# Altium project RJ45_Breakout.PrjPCB
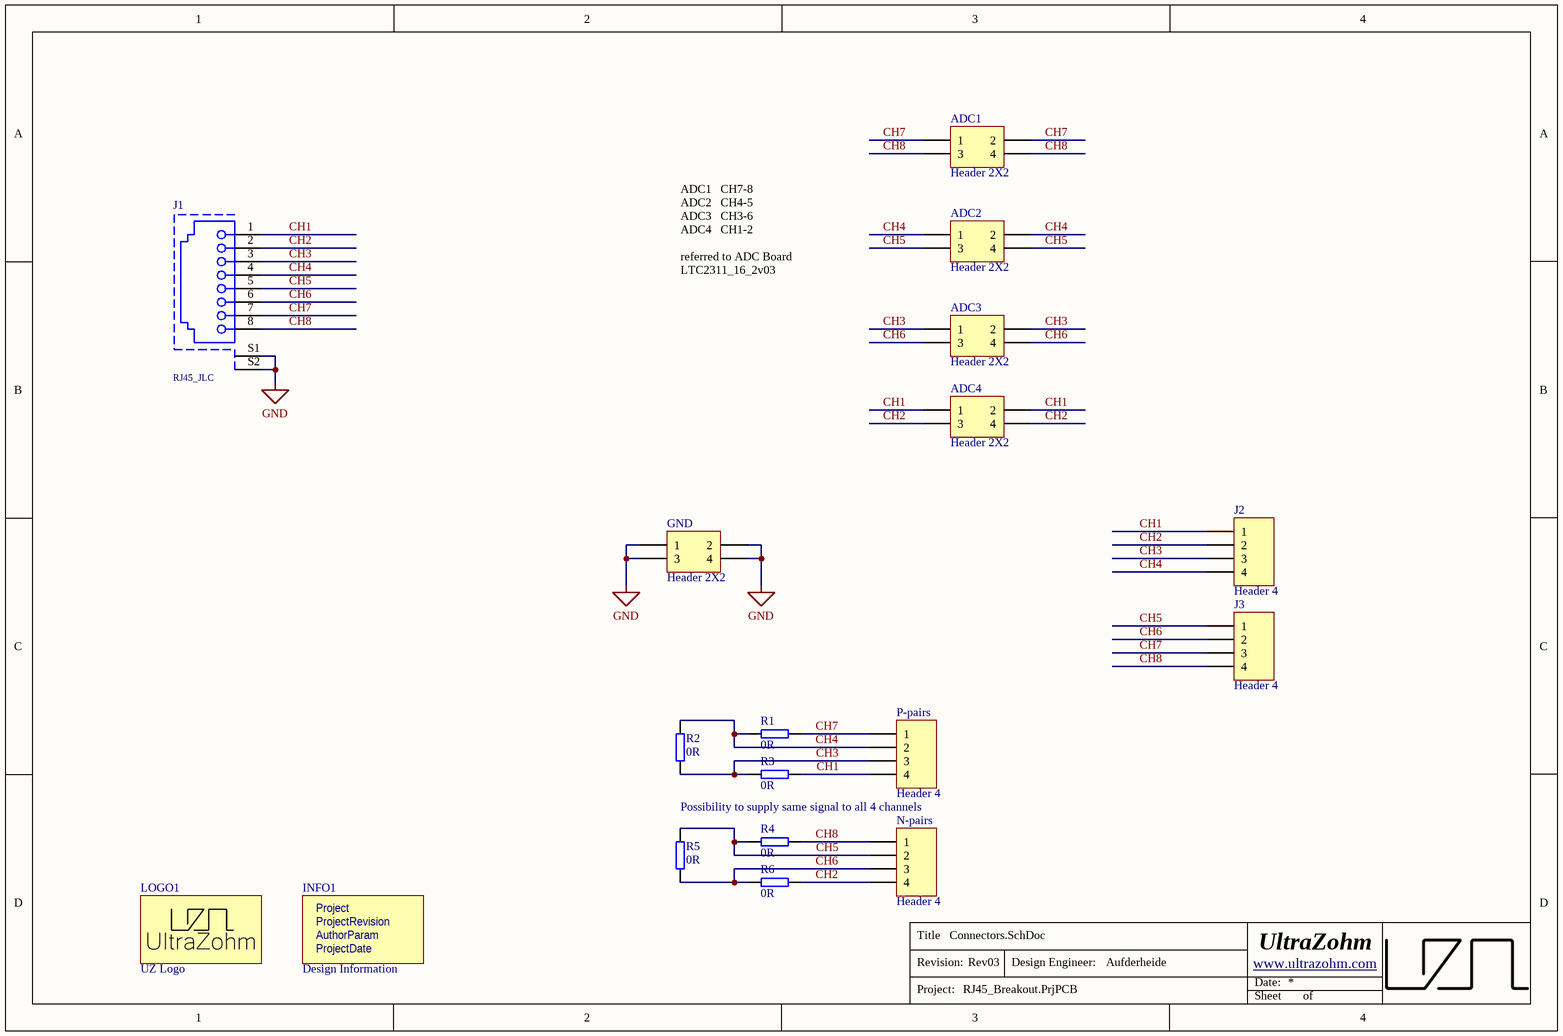
[diagram p0: Connectors.SchDoc]
AuthorParam: Aufderheide; Project: RJ45_Breakout; ProjectDate: 01/23; ProjectRevision: Rev03
1 sheet, 18 parts. Net scope: global (net labels, ports and power ports of the same name join across sheets).
Board file: RJ45_Breakout.PcbDoc

## Sheet Connectors.SchDoc
size A4; Author: Aufderheide; CompanyName: Technische Hochschule Nürnberg Georg Simon Ohm; Organization: UltraZohm; Address1: Kesslerplatz 12; Address2: 90489 Nürnberg; Address3: GERMANY; Website: www.ultrazohm.com

### Parts
ADC1  Header 2X2  [HDR2X2]
ADC2  Header 2X2  [HDR2X2]
ADC3  Header 2X2  [HDR2X2]
ADC4  Header 2X2  [HDR2X2]
GND  Header 2X2  [HDR2X2]
INFO1  Design Information  [Design_info]  (no BOM)
J1  RJ45_JLC  [RJ45_JLC]
J2  Header 4  [HDR1X4]
J3  Header 4  [HDR1X4]
LOGO1  UZ Logo  [UZ_Logo_small]  (no BOM)
N-pairs  Header 4  [HDR1X4]
P-pairs  Header 4  [HDR1X4]
R1  0R  [RES 0603_1608]
R2  0R  [RES 0603_1608]
R3  0R  [RES 0603_1608]
R4  0R  [RES 0603_1608]
R5  0R  [RES 0603_1608]
R6  0R  [RES 0603_1608]

### Nets
GND: GND.1 GND.2 GND.3 GND.4 J1.S1 J1.S2
CH1: ADC4.1 ADC4.2 J1.1 J2.1 P-pairs.4 R3.1
CH2: ADC4.3 ADC4.4 J1.2 J2.2 N-pairs.4 R6.1
CH3: ADC3.1 ADC3.2 J1.3 J2.3 P-pairs.3 R2.1 R3.2
CH4: ADC2.1 ADC2.2 J1.4 J2.4 P-pairs.2 R1.2 R2.2
CH5: ADC2.3 ADC2.4 J1.5 J3.1 N-pairs.2 R4.2 R5.2
CH6: ADC3.3 ADC3.4 J1.6 J3.2 N-pairs.3 R5.1 R6.2
CH7: ADC1.1 ADC1.2 J1.7 J3.3 P-pairs.1 R1.1
CH8: ADC1.3 ADC1.4 J1.8 J3.4 N-pairs.1 R4.1

### Notes on the sheet
- ADC1   CH7-8
  ADC2   CH4-5
  ADC3   CH3-6
  ADC4   CH1-2
  referred to ADC Board LTC2311_16_2v03
- Possibility to supply same signal to all 4 channels
- Title
- Revision:
- Design Engineer:
- Date:
- Project:
- Sheet
- of
- (in symbol Design Information) Project; ProjectRevision; AuthorParam; ProjectDate

### Library data of the parts
ADC1-ADC4 GND = Header 2X2: Header, 2-Pin, Dual row; LatestRevisionDate: 17-Jul-2002; LatestRevisionNote: Re-released for DXP Platform.; Publisher: Altium Limited; LCSC Part #: C160338
INFO1 = Design Information: Manufacturer: UltraZohm; Created from: MGremer; Manufacturer Part Number: Design Information; PartID: 12; Created On: 03.11.2021 09:04:23; ComponentLink1Description: https://docs.ultrazohm.com/; ComponentLink1URL: homepage; Component Type: Design Information; Last Updated: 03.11.2021 09:28:34; Supplier 1: -; Supplier Part Number 1: -; Type: Design Information; Value: Design Information; Live Cycle Status: 1
J1 = RJ45_JLC: Modular Jack WR-MJ, Tab Down, Shielded, Horizontal Entry, THT, 8P8C; Part Number: 61500814221; Port: 1x1; Compliance: Lead free / RoHS; Rated Current: 1.5 A; Working Voltage: 120 VAC; Withstanding Voltage: 1000 VAC; Contact Resistance: 20 mOhm; ComponentLink1Description: Manufacturer; ComponentLink1URL: http://www.we-online.de; ComponentLink2Description: Datasheet; ComponentLink2URL: https://katalog.we-online.de/em/datasheet/61500814221.pdf; Published Date: July 2018; Publisher: Wurth Elektronik; Pin Number: 8P8C; Operating Temperature: -40 to 85 degC; Mounting Technology: THT; Packaging: Tray; Entrance: Horizontal; LCSC Part #: C386758
J2 J3 N-pairs P-pairs = Header 4: Header, 4-Pin; LatestRevisionDate: 17-Jul-2002; LatestRevisionNote: Re-released for DXP Platform.; Publisher: Altium Limited; LCSC Part #: C124378
LOGO1 = Logo small: Manufacturer: UltraZohm; Created from: MGremer; Created: Jan2021_Liegmann; Value: Logo; Manufacturer Part Number: Logo small; PartID: 10; Created On: 03.11.2021 09:04:23; ComponentLink1Description: https://docs.ultrazohm.com/; ComponentLink1URL: homepage; Component Type: Logo; Last Updated: 03.11.2021 09:05:50; Supplier 1: -; Supplier Part Number 1: -; Type: Logo; Live Cycle Status: 1
R1-R6 = RC0603JR-070RL: SMD resistor E24 series; Manufacturer: YAGEO; Tolerance: 5%; Created from: MGremer; Manufacturer Part Number: RC0603JR-070RL; PartID: 1; Created On: 14.12.2020 16:17:14; ComponentLink1Description: Datasheet; ComponentLink1URL: https://www.mouser.de/datasheet/2/447/PYu-RC_Group_51_RoHS_L_10-1664068.pdf; Component Type: SMD resistor; Device Package: 0603; Last Updated: 04.03.2021 09:09:42; Mounting Type: SMD; Supplier 1: Mouser; Supplier Part Number 1: 603-RC0603JR-070RL; Supplier 2: LCSC; Supplier Part Number 2: C21189; Type: Resistor; Value: 0R; Live Cycle Status: 1; Stock number: Labor SMD Container; LCSC Part Number: C21189

## Assembly variants
Default: not fitted R1 R2 R3 R4 R5 R6